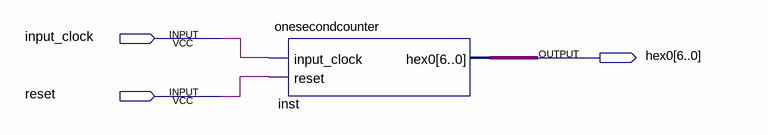
[diagram p0: schematic sheet]
// Quartus schematic ClockCounter.bdf as structural Verilog: 1 symbols, 3 pins
module ClockCounter (
  input  input_clock,
  input  reset,
  output [6:0] hex0
);

  onesecondcounter inst (.input_clock(input_clock), .reset(reset), .hex0(hex0));
endmodule
